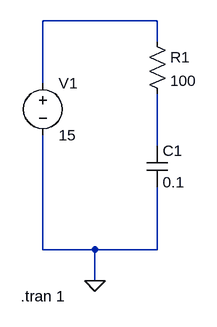
[diagram p0: schematic diviseurTension.asc]
diviseurTension.asc, the LTspice schematic file:
Version 4
SHEET 1 880 680
WIRE 272 -80 96 -80
WIRE 272 -48 272 -80
WIRE 96 16 96 -80
WIRE 272 112 272 32
WIRE 96 272 96 96
WIRE 176 272 96 272
WIRE 272 272 272 176
WIRE 272 272 176 272
WIRE 176 320 176 272
FLAG 176 320 0
SYMBOL res 256 -64 R0
SYMATTR InstName R1
SYMATTR Value 100
SYMBOL voltage 96 0 R0
WINDOW 123 0 0 Left 0
WINDOW 39 0 0 Left 0
SYMATTR InstName V1
SYMATTR Value 15
SYMBOL cap 256 112 R0
SYMATTR InstName C1
SYMATTR Value 0.1
TEXT 62 344 Left 2 !.tran 1

The netlist it stands for:
* diviseurTension.asc
R1 N001 N002 100
V1 N001 0 15
C1 N002 0 0.1
.tran 1
.backanno
.end